# Altium schematic sheet top_dsn.SchDoc
size A4; Date: 1/11/16; Engineer: JBayalas; DocumentNumber: 3; Revision: V1.1; SheetNumber: 3; SheetTotal: 13
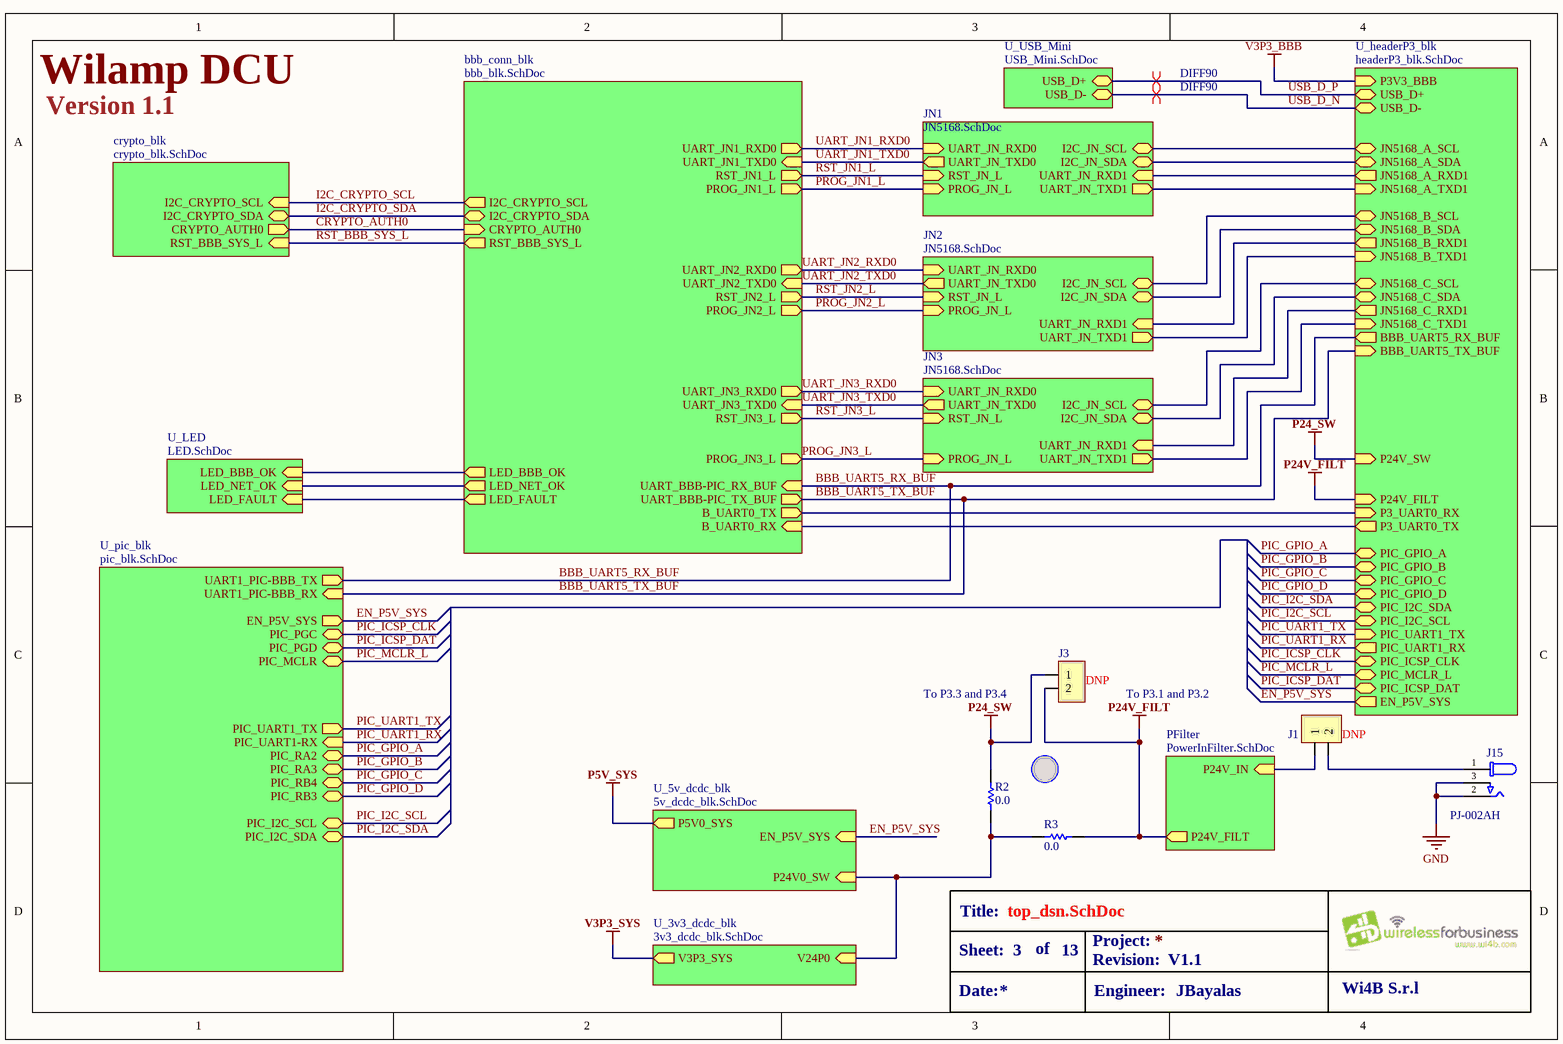
[diagram p0: top_dsn.SchDoc]

## Parts
J1  LOAD: DNP  [2pin 5mm Pitch]  (hidden comment: *)
J3  LOAD: DNP  [2pin 5mm Pitch]  (hidden comment: *)
J15  *  [PJ-002AH]  (value not drawn)
R2  value 0.0  [R0805]  (hidden comment: *)
R3  value 0.0  [R0805]  (hidden comment: *)

## Sub-sheets
bbb_conn_blk = bbb_blk.SchDoc: I2C_CRYPTO_SCL (out), I2C_CRYPTO_SDA (bidir), CRYPTO_AUTH0 (in), RST_BBB_SYS_L (out), UART_JN1_TXD0 (in), UART_JN1_RXD0 (out), UART_JN2_TXD0 (in), UART_JN2_RXD0 (out), UART_JN3_TXD0 (in), UART_JN3_RXD0 (out), LED_NET_OK (out), LED_BBB_OK (out), LED_FAULT (out), RST_JN1_L (out), RST_JN2_L (out), RST_JN3_L (out), PROG_JN1_L (out), PROG_JN2_L (out), PROG_JN3_L (out), UART_BBB-PIC_RX_BUF (in), UART_BBB-PIC_TX_BUF (out), B_UART0_RX (in), B_UART0_TX (out)
crypto_blk = crypto_blk.SchDoc: I2C_CRYPTO_SCL (in), I2C_CRYPTO_SDA (bidir), CRYPTO_AUTH0 (out), RST_BBB_SYS_L (in)
JN1 = JN5168.SchDoc: UART_JN_TXD0 (out), UART_JN_RXD0 (in), I2C_JN_SDA (bidir), I2C_JN_SCL (bidir), RST_JN_L (in), PROG_JN_L (in), UART_JN_TXD1 (out), UART_JN_RXD1 (in)
JN2 = JN5168.SchDoc: UART_JN_TXD0 (out), UART_JN_RXD0 (in), I2C_JN_SDA (bidir), I2C_JN_SCL (bidir), RST_JN_L (in), PROG_JN_L (in), UART_JN_TXD1 (out), UART_JN_RXD1 (in)
JN3 = JN5168.SchDoc: UART_JN_TXD0 (out), UART_JN_RXD0 (in), I2C_JN_SCL (bidir), I2C_JN_SDA (bidir), RST_JN_L (in), PROG_JN_L (in), UART_JN_TXD1 (out), UART_JN_RXD1 (in)
PFilter = PowerInFilter.SchDoc: P24V_FILT (out), P24V_IN (in)
U_3v3_dcdc_blk = 3v3_dcdc_blk.SchDoc: V3P3_SYS (out), V24P0 (in)
U_5v_dcdc_blk = 5v_dcdc_blk.SchDoc: P5V0_SYS (out), P24V0_SW (in), EN_P5V_SYS (in)
U_headerP3_blk = headerP3_blk.SchDoc: P3V3_BBB (in), PIC_ICSP_DAT (bidir), PIC_UART1_RX (out), BBB_UART5_TX_BUF (in), PIC_I2C_SDA (bidir), PIC_GPIO_B (bidir), PIC_GPIO_D (bidir), JN5168_A_RXD1 (out), JN5168_A_SDA (bidir), JN5168_B_RXD1 (out), JN5168_B_SDA (bidir), JN5168_C_RXD1 (out), JN5168_C_SDA (bidir), USB_D- (bidir), EN_P5V_SYS (out), PIC_ICSP_CLK (bidir), PIC_UART1_TX (in), BBB_UART5_RX_BUF (out), PIC_I2C_SCL (bidir), PIC_GPIO_A (bidir), PIC_GPIO_C (bidir), JN5168_A_TXD1 (in), JN5168_A_SCL (bidir), JN5168_B_TXD1 (in), JN5168_B_SCL (bidir), JN5168_C_TXD1 (in), JN5168_C_SCL (bidir), USB_D+ (bidir), PIC_MCLR_L (bidir), P24V_FILT (in), P24V_SW (in), P3_UART0_RX (in), P3_UART0_TX (out)
U_LED = LED.SchDoc: LED_BBB_OK (in), LED_NET_OK (in), LED_FAULT (in)
U_pic_blk = pic_blk.SchDoc: PIC_I2C_SCL (bidir), PIC_I2C_SDA (bidir), PIC_PGD (bidir), PIC_PGC (bidir), PIC_MCLR (bidir), PIC_RA2 (bidir), PIC_RA3 (bidir), UART1_PIC-BBB_RX (in), UART1_PIC-BBB_TX (out), PIC_UART1_TX (out), PIC_UART1-RX (in), EN_P5V_SYS (out), PIC_RB3 (bidir), PIC_RB4 (bidir)
U_USB_Mini = USB_Mini.SchDoc: USB_D+ (bidir), USB_D- (bidir)

## Nets
GND: J15.2 J15.3
P5V_SYS: sheet U_5v_dcdc_blk/P5V0_SYS
P24_SW: J3.1 R2.2 ; sheet U_headerP3_blk/P24V_SW
P24V_FILT: J3.2 R3.2 ; sheet PFilter/P24V_FILT, sheet U_headerP3_blk/P24V_FILT
V3P3_BBB: sheet U_headerP3_blk/P3V3_BBB
V3P3_SYS: sheet U_3v3_dcdc_blk/V3P3_SYS
BBB_UART5_RX_BUF: sheet bbb_conn_blk/UART_BBB-PIC_RX_BUF, sheet U_headerP3_blk/BBB_UART5_RX_BUF, sheet U_pic_blk/UART1_PIC-BBB_TX
BBB_UART5_TX_BUF: sheet bbb_conn_blk/UART_BBB-PIC_TX_BUF, sheet U_headerP3_blk/BBB_UART5_TX_BUF, sheet U_pic_blk/UART1_PIC-BBB_RX
CRYPTO_AUTH0: sheet crypto_blk/CRYPTO_AUTH0, sheet bbb_conn_blk/CRYPTO_AUTH0
EN_P5V_SYS: sheet U_5v_dcdc_blk/EN_P5V_SYS, sheet U_headerP3_blk/EN_P5V_SYS, sheet U_pic_blk/EN_P5V_SYS
I2C_CRYPTO_SCL: sheet crypto_blk/I2C_CRYPTO_SCL, sheet bbb_conn_blk/I2C_CRYPTO_SCL
I2C_CRYPTO_SDA: sheet crypto_blk/I2C_CRYPTO_SDA, sheet bbb_conn_blk/I2C_CRYPTO_SDA
PIC_GPIO_A: sheet U_headerP3_blk/PIC_GPIO_A, sheet U_pic_blk/PIC_RA2
PIC_GPIO_B: sheet U_headerP3_blk/PIC_GPIO_B, sheet U_pic_blk/PIC_RA3
PIC_GPIO_C: sheet U_headerP3_blk/PIC_GPIO_C, sheet U_pic_blk/PIC_RB4
PIC_GPIO_D: sheet U_headerP3_blk/PIC_GPIO_D, sheet U_pic_blk/PIC_RB3
PIC_I2C_SCL: sheet U_headerP3_blk/PIC_I2C_SCL, sheet U_pic_blk/PIC_I2C_SCL
PIC_I2C_SDA: sheet U_headerP3_blk/PIC_I2C_SDA, sheet U_pic_blk/PIC_I2C_SDA
PIC_ICSP_CLK: sheet U_headerP3_blk/PIC_ICSP_CLK, sheet U_pic_blk/PIC_PGC
PIC_ICSP_DAT: sheet U_headerP3_blk/PIC_ICSP_DAT, sheet U_pic_blk/PIC_PGD
PIC_MCLR_L: sheet U_headerP3_blk/PIC_MCLR_L, sheet U_pic_blk/PIC_MCLR
PIC_UART1_RX: sheet U_headerP3_blk/PIC_UART1_RX, sheet U_pic_blk/PIC_UART1-RX
PIC_UART1_TX: sheet U_headerP3_blk/PIC_UART1_TX, sheet U_pic_blk/PIC_UART1_TX
PROG_JN1_L: sheet JN1/PROG_JN_L, sheet bbb_conn_blk/PROG_JN1_L
PROG_JN2_L: sheet JN2/PROG_JN_L, sheet bbb_conn_blk/PROG_JN2_L
PROG_JN3_L: sheet JN3/PROG_JN_L, sheet bbb_conn_blk/PROG_JN3_L
RST_BBB_SYS_L: sheet crypto_blk/RST_BBB_SYS_L, sheet bbb_conn_blk/RST_BBB_SYS_L
RST_JN1_L: sheet JN1/RST_JN_L, sheet bbb_conn_blk/RST_JN1_L
RST_JN2_L: sheet JN2/RST_JN_L, sheet bbb_conn_blk/RST_JN2_L
RST_JN3_L: sheet JN3/RST_JN_L, sheet bbb_conn_blk/RST_JN3_L
UART_JN1_RXD0: sheet JN1/UART_JN_RXD0, sheet bbb_conn_blk/UART_JN1_RXD0
UART_JN1_TXD0: sheet JN1/UART_JN_TXD0, sheet bbb_conn_blk/UART_JN1_TXD0
UART_JN2_RXD0: sheet JN2/UART_JN_RXD0, sheet bbb_conn_blk/UART_JN2_RXD0
UART_JN2_TXD0: sheet JN2/UART_JN_TXD0, sheet bbb_conn_blk/UART_JN2_TXD0
UART_JN3_RXD0: sheet JN3/UART_JN_RXD0, sheet bbb_conn_blk/UART_JN3_RXD0
UART_JN3_TXD0: sheet JN3/UART_JN_TXD0, sheet bbb_conn_blk/UART_JN3_TXD0
USB_D_N: sheet U_USB_Mini/USB_D-, sheet U_headerP3_blk/USB_D-
USB_D_P: sheet U_USB_Mini/USB_D+, sheet U_headerP3_blk/USB_D+
NetJ1_1: J1.1 ; sheet PFilter/P24V_IN
NetJ1_2: J1.2 J15.1
NetR2_1: R2.1 R3.1 ; sheet U_5v_dcdc_blk/P24V0_SW, sheet U_3v3_dcdc_blk/V24P0
(unnamed): sheet JN1/I2C_JN_SDA, sheet U_headerP3_blk/JN5168_A_SDA
(unnamed): sheet JN1/I2C_JN_SCL, sheet U_headerP3_blk/JN5168_A_SCL
(unnamed): sheet JN1/UART_JN_TXD1, sheet U_headerP3_blk/JN5168_A_TXD1
(unnamed): sheet JN1/UART_JN_RXD1, sheet U_headerP3_blk/JN5168_A_RXD1
(unnamed): sheet JN2/I2C_JN_SDA, sheet U_headerP3_blk/JN5168_B_SDA
(unnamed): sheet JN2/I2C_JN_SCL, sheet U_headerP3_blk/JN5168_B_SCL
(unnamed): sheet JN2/UART_JN_TXD1, sheet U_headerP3_blk/JN5168_B_TXD1
(unnamed): sheet JN2/UART_JN_RXD1, sheet U_headerP3_blk/JN5168_B_RXD1
(unnamed): sheet JN3/I2C_JN_SCL, sheet U_headerP3_blk/JN5168_C_SCL
(unnamed): sheet JN3/I2C_JN_SDA, sheet U_headerP3_blk/JN5168_C_SDA
(unnamed): sheet JN3/UART_JN_TXD1, sheet U_headerP3_blk/JN5168_C_TXD1
(unnamed): sheet JN3/UART_JN_RXD1, sheet U_headerP3_blk/JN5168_C_RXD1
(unnamed): sheet bbb_conn_blk/LED_NET_OK, sheet U_LED/LED_NET_OK
(unnamed): sheet bbb_conn_blk/LED_BBB_OK, sheet U_LED/LED_BBB_OK
(unnamed): sheet bbb_conn_blk/LED_FAULT, sheet U_LED/LED_FAULT
(unnamed): sheet bbb_conn_blk/B_UART0_RX, sheet U_headerP3_blk/P3_UART0_TX
(unnamed): sheet bbb_conn_blk/B_UART0_TX, sheet U_headerP3_blk/P3_UART0_RX

## Layout directives
differential pair; net class DIFF90: USB_D_N, USB_D_P

## Notes on the sheet
- Version 1.1
- Wilamp DCU
- (near J3) To P3.3 and P3.4
- To P3.1 and P3.2
- Title:
- Sheet:
- Date:
- of
- Project:
- Revision:
- Engineer:
- Wi4B S.r.l

## Library data of the parts
J1 J3 = 2PIN Signal 5mm Pitch: FUNCTION: TOP
J15 = PJ-002AH: CONN PWR JACK 2.1X5.5MM HIGH CUR; MFT: CUI Inc.; FUNCTION: TOP; VALUE: PJ-002AH; TYPE: TH; RATING: *; LOAD: *; MPN: PJ-002AH
R2 R3 = RC0805JR-070RL: RES SMD 0.0 OHM JUMPER 1/8W 0805; MFT: Yageo; FUNCTION: TOP; MPN: RC0805JR-070RL; TYPE: Surface Mount; RATING: 1/8W